# Altium project LED.PrjPCB
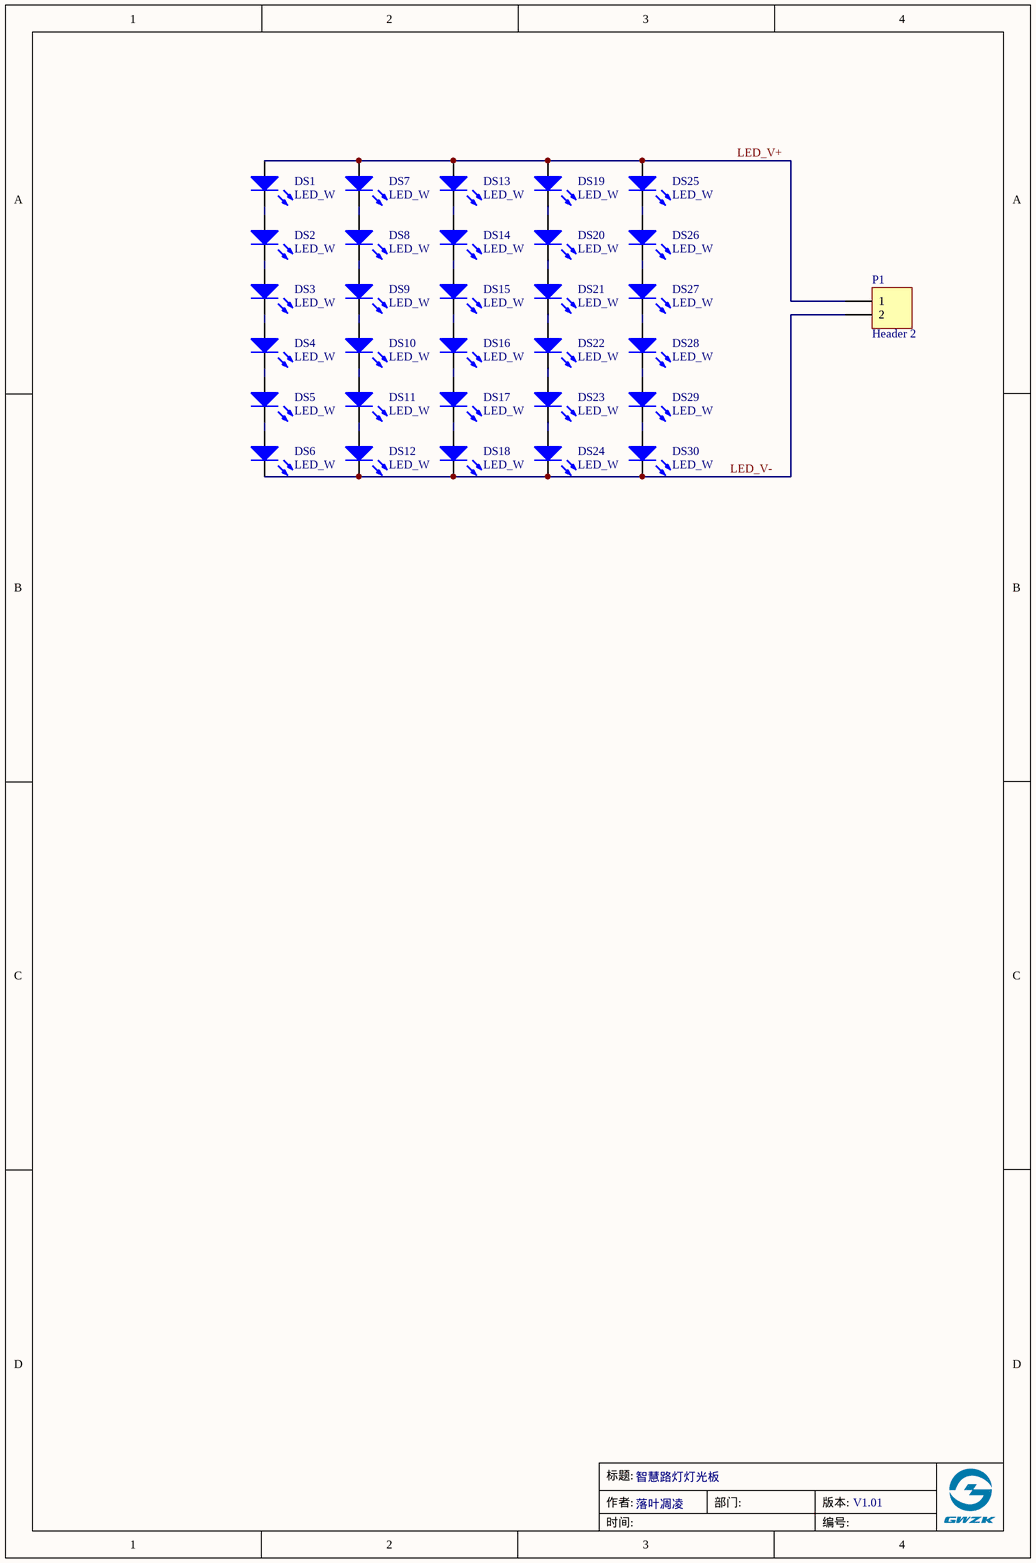
[diagram p0: LED.SchDoc]
1 sheet, 31 parts. Net scope: global (net labels, ports and power ports of the same name join across sheets).
Board file: LED.PcbDoc

## Sheet LED.SchDoc
size A4 portrait; Organization: Altium Limited; Address1: L3, 12a Rodborough Rd; Address2: Frenchs Forest; Address3: NSW; Address4: Australia 2086

### Parts
DS1  LED_W  [LED 3528]
DS2  LED_W  [LED 3528]
DS3  LED_W  [LED 3528]
DS4  LED_W  [LED 3528]
DS5  LED_W  [LED 3528]
DS6  LED_W  [LED 3528]
DS7  LED_W  [LED 3528]
DS8  LED_W  [LED 3528]
DS9  LED_W  [LED 3528]
DS10  LED_W  [LED 3528]
DS11  LED_W  [LED 3528]
DS12  LED_W  [LED 3528]
DS13  LED_W  [LED 3528]
DS14  LED_W  [LED 3528]
DS15  LED_W  [LED 3528]
DS16  LED_W  [LED 3528]
DS17  LED_W  [LED 3528]
DS18  LED_W  [LED 3528]
DS19  LED_W  [LED 3528]
DS20  LED_W  [LED 3528]
DS21  LED_W  [LED 3528]
DS22  LED_W  [LED 3528]
DS23  LED_W  [LED 3528]
DS24  LED_W  [LED 3528]
DS25  LED_W  [LED 3528]
DS26  LED_W  [LED 3528]
DS27  LED_W  [LED 3528]
DS28  LED_W  [LED 3528]
DS29  LED_W  [LED 3528]
DS30  LED_W  [LED 3528]
P1  Header 2  [KF2EDGK5.0-LI-2P]

### Nets
LED_V+: DS1.A DS7.A DS13.A DS19.A DS25.A P1.1
LED_V-: DS6.K DS12.K DS18.K DS24.K DS30.K P1.2
NetDS1_K: DS1.K DS2.A
NetDS2_K: DS2.K DS3.A
NetDS3_K: DS3.K DS4.A
NetDS4_K: DS4.K DS5.A
NetDS5_K: DS5.K DS6.A
NetDS7_K: DS7.K DS8.A
NetDS8_K: DS8.K DS9.A
NetDS9_K: DS9.K DS10.A
NetDS10_K: DS10.K DS11.A
NetDS11_K: DS11.K DS12.A
NetDS13_K: DS13.K DS14.A
NetDS14_K: DS14.K DS15.A
NetDS15_K: DS15.K DS16.A
NetDS16_K: DS16.K DS17.A
NetDS17_K: DS17.K DS18.A
NetDS19_K: DS19.K DS20.A
NetDS20_K: DS20.K DS21.A
NetDS21_K: DS21.K DS22.A
NetDS22_K: DS22.K DS23.A
NetDS23_K: DS23.K DS24.A
NetDS25_K: DS25.K DS26.A
NetDS26_K: DS26.K DS27.A
NetDS27_K: DS27.K DS28.A
NetDS28_K: DS28.K DS29.A
NetDS29_K: DS29.K DS30.A

### Notes on the sheet
- 落叶凋凌
- 智慧路灯灯光板
- V1.01
- 标题:
- 作者:
- 部门:
- 版本:
- 时间:
- 编号:

### Library data of the parts
DS1-DS30 = LED: Typical RED, GREEN, YELLOW, AMBER GaAs LED; Published: 8-Jun-2000; LatestRevisionDate: 17-Jul-2002; LatestRevisionNote: Re-released for DXP Platform.; PackageDocument: Feb-2002; PackageReference: 3.2X1.6X1.1; Publisher: Altium Limited
P1 = Header 2: Header, 2-Pin; LatestRevisionDate: 17-Jul-2002; LatestRevisionNote: Re-released for DXP Platform.; Publisher: Altium Limited